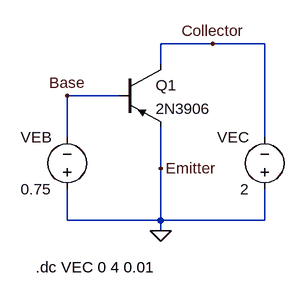
[diagram p0: schematic Lab7p2.asc]
Lab7p2.asc, the LTspice schematic file:
Version 4
SHEET 1 880 680
WIRE 304 -16 224 -16
WIRE 384 -16 304 -16
WIRE 224 16 224 -16
WIRE 160 64 80 64
WIRE 80 128 80 64
WIRE 384 128 384 -16
WIRE 224 176 224 112
WIRE 80 256 80 208
WIRE 224 256 224 176
WIRE 224 256 80 256
WIRE 384 256 384 208
WIRE 384 256 224 256
WIRE 224 272 224 256
FLAG 224 272 0
FLAG 224 176 Emitter
FLAG 80 64 Base
FLAG 304 -16 Collector
SYMBOL voltage 80 224 R180
WINDOW 0 24 96 Left 2
WINDOW 3 24 16 Left 2
WINDOW 123 0 0 Left 0
WINDOW 39 0 0 Left 0
SYMATTR InstName VEB
SYMATTR Value 0.75
SYMBOL voltage 384 224 R180
WINDOW 0 24 96 Left 2
WINDOW 3 24 16 Left 2
WINDOW 123 0 0 Left 0
WINDOW 39 0 0 Left 0
SYMATTR InstName VEC
SYMATTR Value 2
SYMBOL pnp 160 16 R0
SYMATTR InstName Q1
SYMATTR Value 2N3906
TEXT 32 328 Left 2 !.dc VEC 0 4 0.01

The netlist it stands for:
* Lab7p2.asc
VEB 0 Base 0.75
VEC 0 Collector 2
Q1 Collector Base 0 0 2N3906
.model NPN NPN
.model PNP PNP
.lib standard.bjt
.dc VEC 0 4 0.01
.backanno
.end

* Results of the author's LTspice run, read from the files saved beside the schematic
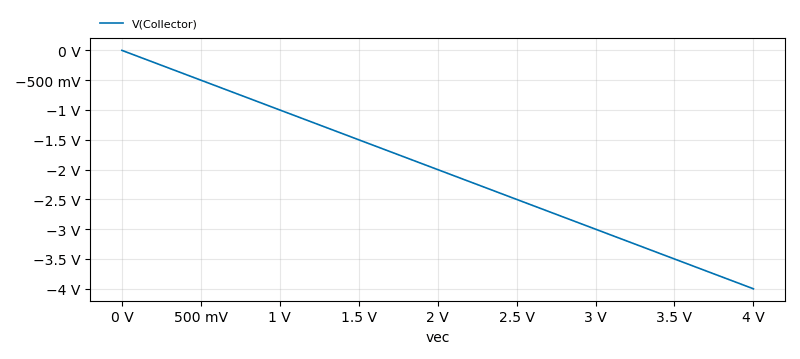
[diagram p1: DC transfer characteristic of Lab7p2.asc, plotted from the saved traces]
* DC transfer characteristic, 1 run:
*   V(Collector): 0 V at vec=0 V, -4 V at vec=4 V, min -4 V, max 0 V